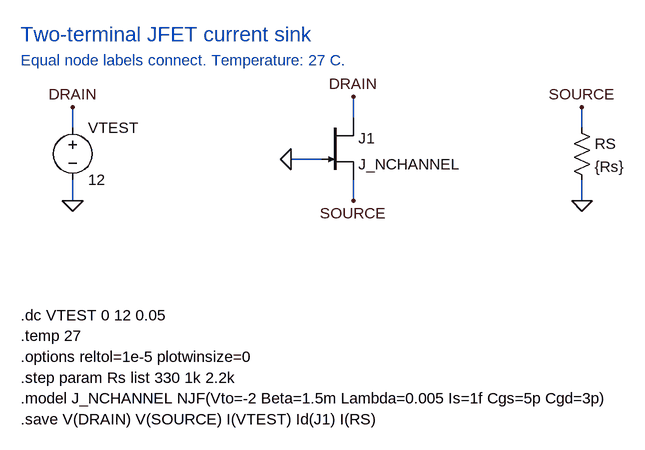
[diagram p0: schematic jfet-current-source.asc]
jfet-current-source.asc, the LTspice schematic file:
Version 4
SHEET 1 1740 776
WIRE 144 176 144 144
WIRE 144 256 144 288
WIRE 576 160 576 128
WIRE 528 224 480 224
WIRE 576 256 576 288
WIRE 928 176 928 144
WIRE 928 256 928 288
FLAG 144 144 DRAIN
FLAG 144 288 0
FLAG 576 128 DRAIN
FLAG 480 224 0
FLAG 576 288 SOURCE
FLAG 928 144 SOURCE
FLAG 928 288 0
SYMBOL voltage 144 160 R0
SYMATTR InstName VTEST
SYMATTR Value 12
SYMBOL njf 528 160 R0
SYMATTR InstName J1
SYMATTR Value J_NCHANNEL
SYMBOL res 912 160 R0
SYMATTR InstName RS
SYMATTR Value {Rs}
TEXT 64 32 Left 3 ;Two-terminal JFET current sink
TEXT 64 72 Left 2 ;Equal node labels connect. Temperature: 27 C.
TEXT 64 464 Left 2 !.dc VTEST 0 12 0.05
TEXT 64 496 Left 2 !.temp 27
TEXT 64 528 Left 2 !.options reltol=1e-5 plotwinsize=0
TEXT 64 560 Left 2 !.step param Rs list 330 1k 2.2k
TEXT 64 592 Left 2 !.model J_NCHANNEL NJF(Vto=-2 Beta=1.5m Lambda=0.005 Is=1f Cgs=5p Cgd=3p)
TEXT 64 624 Left 2 !.save V(DRAIN) V(SOURCE) I(VTEST) Id(J1) I(RS)

The netlist it stands for:
* jfet-current-source.asc
VTEST DRAIN 0 12
J1 DRAIN 0 SOURCE J_NCHANNEL
RS SOURCE 0 {Rs}
.model NJF NJF
.model PJF PJF
.lib standard.jft
* Two-terminal JFET current sink
* Equal node labels connect. Temperature: 27 C.
.dc VTEST 0 12 0.05
.temp 27
.options reltol=1e-5 plotwinsize=0
.step param Rs list 330 1k 2.2k
.model J_NCHANNEL NJF(Vto=-2 Beta=1.5m Lambda=0.005 Is=1f Cgs=5p Cgd=3p)
.save V(DRAIN) V(SOURCE) I(VTEST) Id(J1) I(RS)
.backanno
.end